# Altium schematic sheet FPGA-Oscilloscope.SchDoc: FPGA Oscilloscope
size C; Author: Albert Gural; DrawnBy: Albert Gural; Engineer: Albert Gural; Revision: 1; SheetNumber: 1; DocumentName: FPGA Oscilloscope
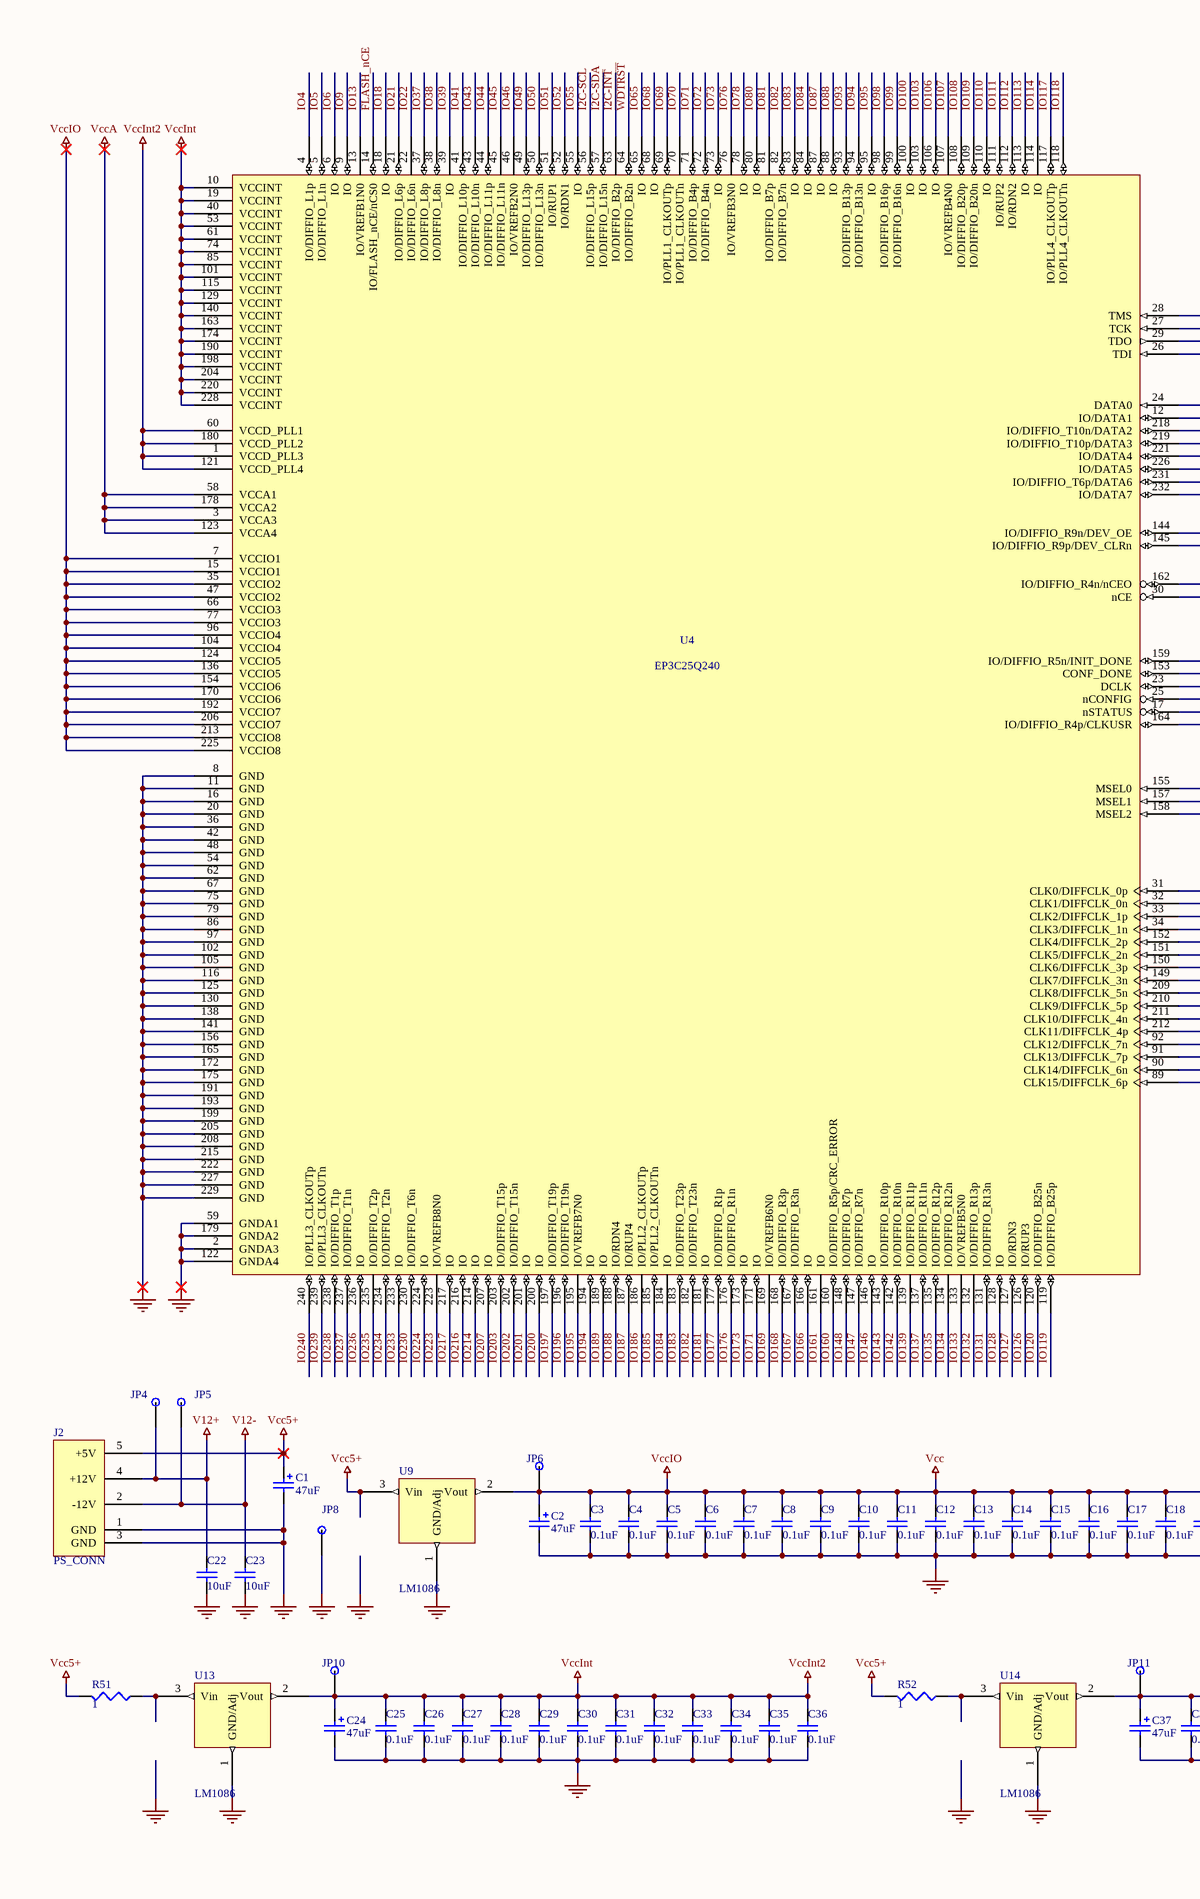
[diagram p0: FPGA-Oscilloscope.SchDoc, left]
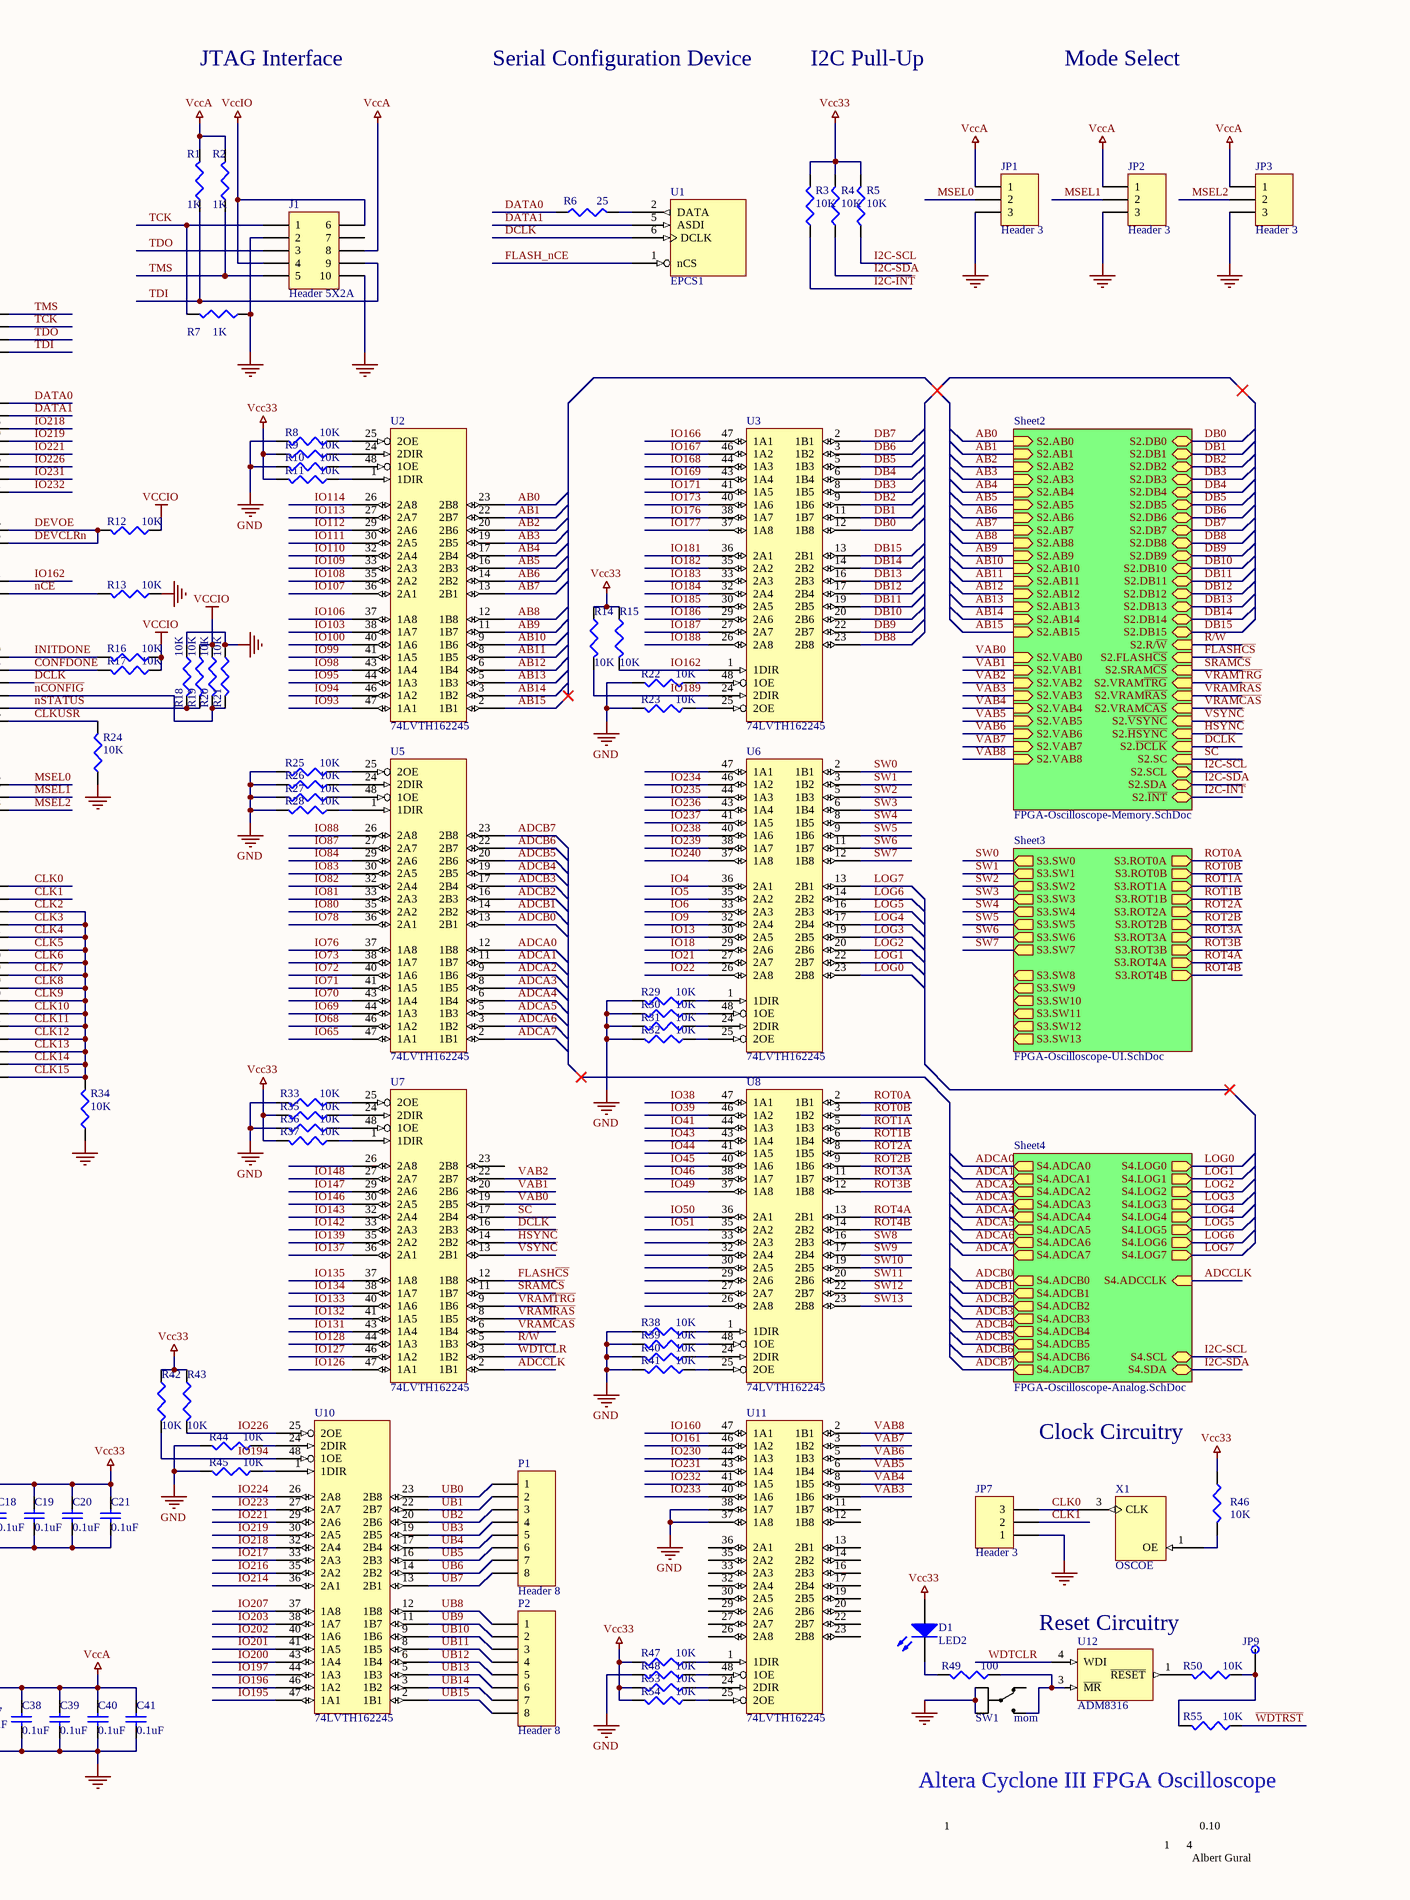
[diagram p1: FPGA-Oscilloscope.SchDoc, right]

## Parts
C1  47uF  [CAPR5-4X5]
C2  47uF  [CAPR5-4X5]
C3  0.1uF  [1608[0603]]
C4  0.1uF  [1608[0603]]
C5  0.1uF  [1608[0603]]
C6  0.1uF  [1608[0603]]
C7  0.1uF  [1608[0603]]
C8  0.1uF  [1608[0603]]
C9  0.1uF  [1608[0603]]
C10  0.1uF  [1608[0603]]
C11  0.1uF  [1608[0603]]
C12  0.1uF  [1608[0603]]
C13  0.1uF  [1608[0603]]
C14  0.1uF  [1608[0603]]
C15  0.1uF  [1608[0603]]
C16  0.1uF  [1608[0603]]
C17  0.1uF  [1608[0603]]
C18  0.1uF  [1608[0603]]
C19  0.1uF  [1608[0603]]
C20  0.1uF  [1608[0603]]
C21  0.1uF  [1608[0603]]
C22  10uF  [1608[0603]]
C23  10uF  [1608[0603]]
C24  47uF  [CAPR5-4X5]
C25  0.1uF  [1608[0603]]
C26  0.1uF  [1608[0603]]
C27  0.1uF  [1608[0603]]
C28  0.1uF  [1608[0603]]
C29  0.1uF  [1608[0603]]
C30  0.1uF  [1608[0603]]
C31  0.1uF  [1608[0603]]
C32  0.1uF  [1608[0603]]
C33  0.1uF  [1608[0603]]
C34  0.1uF  [1608[0603]]
C35  0.1uF  [1608[0603]]
C36  0.1uF  [1608[0603]]
C37  47uF  [CAPR5-4X5]
C38  0.1uF  [1608[0603]]
C39  0.1uF  [1608[0603]]
C40  0.1uF  [1608[0603]]
C41  0.1uF  [1608[0603]]
D1  LED2  [3.2X1.6X1.1]
J1  Header 5X2A  [HDR2X5_CEN]
J2  PS_CONN  [DIN5]
JP1  Header 3  [HDR1X3]
JP2  Header 3  [HDR1X3]
JP3  Header 3  [HDR1X3]
JP4  TestPoint  [TestPoint]  (value not drawn)
JP5  TestPoint  [TestPoint]  (value not drawn)
JP6  TestPoint  [TestPoint]  (value not drawn)
JP7  Header 3  [HDR1X3]
JP8  TestPoint  [TestPoint]  (value not drawn)
JP9  TestPoint  [TestPoint]  (value not drawn)
JP10  TestPoint  [TestPoint]  (value not drawn)
JP11  TestPoint  [TestPoint]  (value not drawn)
P1  Header 8  [HDR1X8]
P2  Header 8  [HDR1X8]
R1  1K  [1608[0603]]
R2  1K  [1608[0603]]
R3  10K  [1608[0603]]
R4  10K  [1608[0603]]
R5  10K  [1608[0603]]
R6  25  [1608[0603]]
R7  1K  [1608[0603]]
R8  10K  [1608[0603]]
R9  10K  [1608[0603]]
R10  10K  [1608[0603]]
R11  10K  [1608[0603]]
R12  10K  [1608[0603]]
R13  10K  [1608[0603]]
R14  10K  [1608[0603]]
R15  10K  [1608[0603]]
R16  10K  [1608[0603]]
R17  10K  [1608[0603]]
R18  10K  [1608[0603]]
R19  10K  [1608[0603]]
R20  10K  [1608[0603]]
R21  10K  [1608[0603]]
R22  10K  [1608[0603]]
R23  10K  [1608[0603]]
R24  10K  [1608[0603]]
R25  10K  [1608[0603]]
R26  10K  [1608[0603]]
R27  10K  [1608[0603]]
R28  10K  [1608[0603]]
R29  10K  [1608[0603]]
R30  10K  [1608[0603]]
R31  10K  [1608[0603]]
R32  10K  [1608[0603]]
R33  10K  [1608[0603]]
R34  10K  [1608[0603]]
R35  10K  [1608[0603]]
R36  10K  [1608[0603]]
R37  10K  [1608[0603]]
R38  10K  [1608[0603]]
R39  10K  [1608[0603]]
R40  10K  [1608[0603]]
R41  10K  [1608[0603]]
R42  10K  [1608[0603]]
R43  10K  [1608[0603]]
R44  10K  [1608[0603]]
R45  10K  [1608[0603]]
R46  10K  [1608[0603]]
R47  10K  [1608[0603]]
R48  10K  [1608[0603]]
R49  100  [1608[0603]]
R50  10K  [1608[0603]]
R51  1  [AXIAL-0.7]
R52  1  [AXIAL-0.7]
R53  10K  [1608[0603]]
R54  10K  [1608[0603]]
R55  10K  [1608[0603]]
SW1  mom  [SPDT]
U1  EPCS1  [SO-8]
U2  74LVTH162245  [TSSOP48]
U3  74LVTH162245  [TSSOP48]
U4  EP3C25Q240  [PQFP240]
U5  74LVTH162245  [TSSOP48]
U6  74LVTH162245  [TSSOP48]
U7  74LVTH162245  [TSSOP48]
U8  74LVTH162245  [TSSOP48]
U9  LM1086  [TO-263]
U10  74LVTH162245  [TSSOP48]
U11  74LVTH162245  [TSSOP48]
U12  ADM8316  [SOT-23]
U13  LM1086  [TO-263]
U14  LM1086  [TO-263]
X1  OSCOE  [OSC-3.2x2.5]

## Sub-sheets
Sheet2 = FPGA-Oscilloscope-Memory.SchDoc: S2.AB0 (in), S2.AB1 (in), S2.AB2 (in), S2.AB3 (in), S2.AB4 (in), S2.AB5 (in), S2.AB6 (in), S2.AB7 (in), S2.AB8 (in), S2.AB9 (in), S2.AB10 (in), S2.AB11 (in), S2.AB12 (in), S2.AB13 (in), S2.AB14 (in), S2.AB15 (in), S2.DB0 (bidir), S2.DB1 (bidir), S2.DB2 (bidir), S2.DB3 (bidir), S2.DB4 (bidir), S2.DB5 (bidir), S2.DB6 (bidir), S2.DB7 (bidir), S2.DB8 (bidir), S2.DB9 (bidir), S2.DB10 (bidir), S2.DB11 (bidir), S2.DB12 (bidir), S2.DB13 (bidir), S2.DB14 (bidir), S2.DB15 (bidir), S2.R/~{W} (in), S2.FLASH~{CS} (in), S2.SRAM~{CS} (in), S2.VRAM~{TRG} (in), S2.VRAM~{RAS} (in), S2.VRAM~{CAS} (in), S2.SC (in), S2.~{DCLK} (in), S2.~{HSYNC} (in), S2.~{VSYNC} (in), S2.SCL (bidir), S2.SDA (bidir), S2.~{INT} (bidir), S2.VAB0 (in), S2.VAB1 (in), S2.VAB2 (in), S2.VAB3 (in), S2.VAB4 (in), S2.VAB5 (in), S2.VAB6 (in), S2.VAB7 (in), S2.VAB8 (in)
Sheet3 = FPGA-Oscilloscope-UI.SchDoc: S3.SW0 (out), S3.SW1 (out), S3.SW2 (out), S3.SW3 (out), S3.SW4 (out), S3.SW5 (out), S3.SW6 (out), S3.SW7 (out), S3.SW8 (out), S3.SW9 (out), S3.SW10 (out), S3.SW11 (out), S3.SW12 (out), S3.SW13 (out), S3.ROT0A (out), S3.ROT0B (out), S3.ROT1A (out), S3.ROT1B (out), S3.ROT2A (out), S3.ROT2B (out), S3.ROT3A (out), S3.ROT3B (out), S3.ROT4A (out), S3.ROT4B (out)
Sheet4 = FPGA-Oscilloscope-Analog.SchDoc: S4.ADCA0 (out), S4.LOG0 (out), S4.SCL (bidir), S4.SDA (bidir), S4.ADCCLK (in), S4.ADCA1 (out), S4.ADCA2 (out), S4.ADCA3 (out), S4.ADCA4 (out), S4.ADCA5 (out), S4.ADCA6 (out), S4.ADCA7 (out), S4.LOG1 (out), S4.LOG2 (out), S4.LOG3 (out), S4.LOG4 (out), S4.LOG5 (out), S4.LOG6 (out), S4.LOG7 (out), S4.ADCB0 (out), S4.ADCB1 (out), S4.ADCB2 (out), S4.ADCB3 (out), S4.ADCB4 (out), S4.ADCB5 (out), S4.ADCB6 (out), S4.ADCB7 (out)

## Nets
GND: C1.2 C2.2 C3.1 C4.1 C5.1 C6.1 C7.1 C8.1 C9.1 C10.1 C11.1 C12.1 C13.1 C14.1 C15.1 C16.1 C17.1 C18.1 C19.1 C20.1 C21.1 C22.1 C23.1 C24.2 C25.1 C26.1 C27.1 C28.1 C29.1 C30.1 C31.1 C32.1 C33.1 C34.1 C35.1 C36.1 C37.2 C38.1 C39.1 C40.1 C41.1 J1.2 J1.10 J2.1(GND) J2.3(GND) JP1.3 JP2.3 JP3.3 JP7.1 JP8.1 R7.1 R8.2 R10.2 R13.1 R18.1 R21.1 R22.2 R23.2 R24.1 R25.2 R26.2 R27.2 R28.2 R29.2 R30.2 R31.2 R32.2 R33.2 R34.1 R36.2 R38.2 R39.2 R40.2 R41.2 R44.2 R45.2 R48.2 SW1.C U1.4(GND) U2.4(GND) U2.10(GND) U2.15(GND) U2.21(GND) U2.28(GND) U2.34(GND) U2.39(GND) U2.45(GND) U3.4(GND) U3.10(GND) U3.15(GND) U3.21(GND) U3.28(GND) U3.34(GND) U3.39(GND) U3.45(GND) U4.2(GNDA3) U4.8(GND) U4.11(GND) U4.16(GND) U4.20(GND) U4.36(GND) U4.42(GND) U4.48(GND) U4.54(GND) U4.59(GNDA1) U4.62(GND) U4.67(GND) U4.75(GND) U4.79(GND) U4.86(GND) U4.97(GND) U4.102(GND) U4.105(GND) U4.116(GND) U4.122(GNDA4) U4.125(GND) U4.130(GND) U4.138(GND) U4.141(GND) U4.156(GND) U4.165(GND) U4.172(GND) U4.175(GND) U4.179(GNDA2) U4.191(GND) U4.193(GND) U4.199(GND) U4.205(GND) U4.208(GND) U4.215(GND) U4.222(GND) U4.227(GND) U4.229(GND) U5.4(GND) U5.10(GND) U5.15(GND) U5.21(GND) U5.28(GND) U5.34(GND) U5.39(GND) U5.45(GND) U6.4(GND) U6.10(GND) U6.15(GND) U6.21(GND) U6.28(GND) U6.34(GND) U6.39(GND) U6.45(GND) U7.4(GND) U7.10(GND) U7.15(GND) U7.21(GND) U7.28(GND) U7.34(GND) U7.39(GND) U7.45(GND) U8.4(GND) U8.10(GND) U8.15(GND) U8.21(GND) U8.28(GND) U8.34(GND) U8.39(GND) U8.45(GND) U9.1(GND/Adj) U10.4(GND) U10.10(GND) U10.15(GND) U10.21(GND) U10.28(GND) U10.34(GND) U10.39(GND) U10.45(GND) U11.4(GND) U11.10(GND) U11.15(GND) U11.21(GND) U11.28(GND) U11.34(GND) U11.37(1A8) U11.38(1A7) U11.39(GND) U11.45(GND) U12.2(GND) U13.1(GND/Adj) U14.1(GND/Adj) X1.2(GND)
V12+: C22.2 J2.4(+12V) JP4.1
V12-: C23.2 J2.2(-12V) JP5.1
Vcc: C2.1 C3.2 C4.2 C5.2 C6.2 C7.2 C8.2 C9.2 C10.2 C11.2 C12.2 C13.2 C14.2 C15.2 C16.2 C17.2 C18.2 C19.2 C20.2 C21.2 D1.1(A) J1.4 J1.6 JP6.1 R3.2 R4.2 R5.2 R9.2 R11.2 R12.1 R14.1 R15.1 R16.1 R17.1 R19.1 R20.1 R35.2 R37.2 R42.1 R43.1 R46.1 R47.2 R53.2 R54.2 U1.3(Vcc) U1.7(Vcc) U1.8(Vcc) U2.7(Vcc33) U2.18(Vcc33) U2.31(Vcc33) U2.42(Vcc33) U3.7(Vcc33) U3.18(Vcc33) U3.31(Vcc33) U3.42(Vcc33) U4.7(VCCIO1) U4.15(VCCIO1) U4.35(VCCIO2) U4.47(VCCIO2) U4.66(VCCIO3) U4.77(VCCIO3) U4.96(VCCIO4) U4.104(VCCIO4) U4.124(VCCIO5) U4.136(VCCIO5) U4.154(VCCIO6) U4.170(VCCIO6) U4.192(VCCIO7) U4.206(VCCIO7) U4.213(VCCIO8) U4.225(VCCIO8) U5.7(Vcc33) U5.18(Vcc33) U5.31(Vcc33) U5.42(Vcc33) U6.7(Vcc33) U6.18(Vcc33) U6.31(Vcc33) U6.42(Vcc33) U7.7(Vcc33) U7.18(Vcc33) U7.31(Vcc33) U7.42(Vcc33) U8.7(Vcc33) U8.18(Vcc33) U8.31(Vcc33) U8.42(Vcc33) U9.2(Vout) U10.7(Vcc33) U10.18(Vcc33) U10.31(Vcc33) U10.42(Vcc33) U11.7(Vcc33) U11.18(Vcc33) U11.31(Vcc33) U11.42(Vcc33) U12.5(VCC) X1.4(VCC)  [also labelled Vcc33, VccIO]
Vcc5+: C1.1 J2.5(+5V) R51.2 R52.2 U9.3(Vin)
VccA: C37.1 C38.2 C39.2 C40.2 C41.2 J1.8 JP1.1 JP2.1 JP3.1 JP11.1 R1.2 R2.2 U4.3(VCCA3) U4.58(VCCA1) U4.123(VCCA4) U4.178(VCCA2) U14.2(Vout)
VccInt: C24.1 C25.2 C26.2 C27.2 C28.2 C29.2 C30.2 C31.2 C32.2 C33.2 C34.2 C35.2 C36.2 JP10.1 U4.1(VCCD_PLL3) U4.10(VCCINT) U4.19(VCCINT) U4.40(VCCINT) U4.53(VCCINT) U4.60(VCCD_PLL1) U4.61(VCCINT) U4.74(VCCINT) U4.85(VCCINT) U4.101(VCCINT) U4.115(VCCINT) U4.121(VCCD_PLL4) U4.129(VCCINT) U4.140(VCCINT) U4.163(VCCINT) U4.174(VCCINT) U4.180(VCCD_PLL2) U4.190(VCCINT) U4.198(VCCINT) U4.204(VCCINT) U4.220(VCCINT) U4.228(VCCINT) U13.2(Vout)  [also labelled VccInt2]
AB0: U2.23(2B8) ; sheet Sheet2/S2.AB0
AB1: U2.22(2B7) ; sheet Sheet2/S2.AB1
AB2: U2.20(2B6) ; sheet Sheet2/S2.AB2
AB3: U2.19(2B5) ; sheet Sheet2/S2.AB3
AB4: U2.17(2B4) ; sheet Sheet2/S2.AB4
AB5: U2.16(2B3) ; sheet Sheet2/S2.AB5
AB6: U2.14(2B2) ; sheet Sheet2/S2.AB6
AB7: U2.13(2B1) ; sheet Sheet2/S2.AB7
AB8: U2.12(1B8) ; sheet Sheet2/S2.AB8
AB9: U2.11(1B7) ; sheet Sheet2/S2.AB9
AB10: U2.9(1B6) ; sheet Sheet2/S2.AB10
AB11: U2.8(1B5) ; sheet Sheet2/S2.AB11
AB12: U2.6(1B4) ; sheet Sheet2/S2.AB12
AB13: U2.5(1B3) ; sheet Sheet2/S2.AB13
AB14: U2.3(1B2) ; sheet Sheet2/S2.AB14
AB15: U2.2(1B1) ; sheet Sheet2/S2.AB15
ADCA0: U5.12(1B8) ; sheet Sheet4/S4.ADCA0
ADCA1: U5.11(1B7) ; sheet Sheet4/S4.ADCA1
ADCA2: U5.9(1B6) ; sheet Sheet4/S4.ADCA2
ADCA3: U5.8(1B5) ; sheet Sheet4/S4.ADCA3
ADCA4: U5.6(1B4) ; sheet Sheet4/S4.ADCA4
ADCA5: U5.5(1B3) ; sheet Sheet4/S4.ADCA5
ADCA6: U5.3(1B2) ; sheet Sheet4/S4.ADCA6
ADCA7: U5.2(1B1) ; sheet Sheet4/S4.ADCA7
ADCB0: U5.13(2B1) ; sheet Sheet4/S4.ADCB0
ADCB1: U5.14(2B2) ; sheet Sheet4/S4.ADCB1
ADCB2: U5.16(2B3) ; sheet Sheet4/S4.ADCB2
ADCB3: U5.17(2B4) ; sheet Sheet4/S4.ADCB3
ADCB4: U5.19(2B5) ; sheet Sheet4/S4.ADCB4
ADCB5: U5.20(2B6) ; sheet Sheet4/S4.ADCB5
ADCB6: U5.22(2B7) ; sheet Sheet4/S4.ADCB6
ADCB7: U5.23(2B8) ; sheet Sheet4/S4.ADCB7
ADCCLK: U7.2(1B1) ; sheet Sheet4/S4.ADCCLK
CLK0: JP7.3 U4.31(CLK0/DIFFCLK_0p) X1.3(CLK)
CLK1: JP7.2 U4.32(CLK1/DIFFCLK_0n)
CLK10: R34.2 U4.33(CLK2/DIFFCLK_1p) U4.34(CLK3/DIFFCLK_1n) U4.89(CLK15/DIFFCLK_6p) U4.90(CLK14/DIFFCLK_6n) U4.91(CLK13/DIFFCLK_7p) U4.92(CLK12/DIFFCLK_7n) U4.149(CLK7/DIFFCLK_3n) U4.150(CLK6/DIFFCLK_3p) U4.151(CLK5/DIFFCLK_2n) U4.152(CLK4/DIFFCLK_2p) U4.209(CLK8/DIFFCLK_5n) U4.210(CLK9/DIFFCLK_5p) U4.211(CLK10/DIFFCLK_4n) U4.212(CLK11/DIFFCLK_4p)  [also labelled CLK11, CLK12, CLK13, CLK14, CLK15, CLK2, CLK3, CLK4, CLK5, CLK6, CLK7, CLK8, CLK9]
CLKUSR: R24.2 U4.164(IO/DIFFIO_R4p/CLKUSR)
CONFDONE: R17.2 U4.153(CONF_DONE)
~{DCLK}: U7.16(2B3) ; sheet Sheet2/S2.~{DCLK}
DATA0: R6.1 U4.24(DATA0)
DATA1: U1.5(ASDI) U4.12(IO/DATA1)
DB0: U3.12(1B8) ; sheet Sheet2/S2.DB0
DB1: U3.11(1B7) ; sheet Sheet2/S2.DB1
DB2: U3.9(1B6) ; sheet Sheet2/S2.DB2
DB3: U3.8(1B5) ; sheet Sheet2/S2.DB3
DB4: U3.6(1B4) ; sheet Sheet2/S2.DB4
DB5: U3.5(1B3) ; sheet Sheet2/S2.DB5
DB6: U3.3(1B2) ; sheet Sheet2/S2.DB6
DB7: U3.2(1B1) ; sheet Sheet2/S2.DB7
DB8: U3.23(2B8) ; sheet Sheet2/S2.DB8
DB9: U3.22(2B7) ; sheet Sheet2/S2.DB9
DB10: U3.20(2B6) ; sheet Sheet2/S2.DB10
DB11: U3.19(2B5) ; sheet Sheet2/S2.DB11
DB12: U3.17(2B4) ; sheet Sheet2/S2.DB12
DB13: U3.16(2B3) ; sheet Sheet2/S2.DB13
DB14: U3.14(2B2) ; sheet Sheet2/S2.DB14
DB15: U3.13(2B1) ; sheet Sheet2/S2.DB15
DCLK: U1.6(DCLK) U4.23(DCLK)
DEVCLRn: R12.2 U4.144(IO/DIFFIO_R9n/DEV_OE) U4.145(IO/DIFFIO_R9p/DEV_CLRn)  [also labelled DEVOE]
FLASH_nCE: U1.1(nCS) U4.14(IO/FLASH_nCE/nCS0)
FLASH~{CS}: U7.12(1B8) ; sheet Sheet2/S2.FLASH~{CS}
~{HSYNC}: U7.14(2B2) ; sheet Sheet2/S2.~{HSYNC}
I2C-~{INT}: R3.1 U4.63(IO/DIFFIO_B2p) ; sheet Sheet2/S2.~{INT}
I2C-SCL: R5.1 U4.56(IO/DIFFIO_L15p) ; sheet Sheet2/S2.SCL, sheet Sheet4/S4.SCL
I2C-SDA: R4.1 U4.57(IO/DIFFIO_L15n) ; sheet Sheet2/S2.SDA, sheet Sheet4/S4.SDA
INITDONE: R16.2 U4.159(IO/DIFFIO_R5n/INIT_DONE)
IO4: U4.4(IO/DIFFIO_L1p) U6.36(2A1)
IO5: U4.5(IO/DIFFIO_L1n) U6.35(2A2)
IO6: U4.6(IO) U6.33(2A3)
IO9: U4.9(IO) U6.32(2A4)
IO13: U4.13(IO/VREFB1N0) U6.30(2A5)
IO18: U4.18(IO) U6.29(2A6)
IO21: U4.21(IO/DIFFIO_L6p) U6.27(2A7)
IO22: U4.22(IO/DIFFIO_L6n) U6.26(2A8)
IO37: U4.37(IO/DIFFIO_L8p)
IO38: U4.38(IO/DIFFIO_L8n) U8.47(1A1)
IO39: U4.39(IO) U8.46(1A2)
IO41: U4.41(IO/DIFFIO_L10p) U8.44(1A3)
IO43: U4.43(IO/DIFFIO_L10n) U8.43(1A4)
IO44: U4.44(IO/DIFFIO_L11p) U8.41(1A5)
IO45: U4.45(IO/DIFFIO_L11n) U8.40(1A6)
IO46: U4.46(IO/VREFB2N0) U8.38(1A7)
IO49: U4.49(IO/DIFFIO_L13p) U8.37(1A8)
IO50: U4.50(IO/DIFFIO_L13n) U8.36(2A1)
IO51: U4.51(IO/RUP1) U8.35(2A2)
IO52: U4.52(IO/RDN1)
IO55: U4.55(IO)
IO65: U4.65(IO) U5.47(1A1)
IO68: U4.68(IO) U5.46(1A2)
IO69: U4.69(IO/PLL1_CLKOUTp) U5.44(1A3)
IO70: U4.70(IO/PLL1_CLKOUTn) U5.43(1A4)
IO71: U4.71(IO/DIFFIO_B4p) U5.41(1A5)
IO72: U4.72(IO/DIFFIO_B4n) U5.40(1A6)
IO73: U4.73(IO) U5.38(1A7)
IO76: U4.76(IO/VREFB3N0) U5.37(1A8)
IO78: U4.78(IO) U5.36(2A1)
IO80: U4.80(IO) U5.35(2A2)
IO81: U4.81(IO/DIFFIO_B7p) U5.33(2A3)
IO82: U4.82(IO/DIFFIO_B7n) U5.32(2A4)
IO83: U4.83(IO) U5.30(2A5)
IO84: U4.84(IO) U5.29(2A6)
IO87: U4.87(IO) U5.27(2A7)
IO88: U4.88(IO) U5.26(2A8)
IO93: U2.47(1A1) U4.93(IO/DIFFIO_B13p)
IO94: U2.46(1A2) U4.94(IO/DIFFIO_B13n)
IO95: U2.44(1A3) U4.95(IO)
IO98: U2.43(1A4) U4.98(IO/DIFFIO_B16p)
IO99: U2.41(1A5) U4.99(IO/DIFFIO_B16n)
IO100: U2.40(1A6) U4.100(IO)
IO103: U2.38(1A7) U4.103(IO)
IO106: U2.37(1A8) U4.106(IO)
IO107: U2.36(2A1) U4.107(IO/VREFB4N0)
IO108: U2.35(2A2) U4.108(IO/DIFFIO_B20p)
IO109: U2.33(2A3) U4.109(IO/DIFFIO_B20n)
IO110: U2.32(2A4) U4.110(IO)
IO111: U2.30(2A5) U4.111(IO/RUP2)
IO112: U2.29(2A6) U4.112(IO/RDN2)
IO113: U2.27(2A7) U4.113(IO)
IO114: U2.26(2A8) U4.114(IO)
IO117: U4.117(IO/PLL4_CLKOUTp)
IO118: U4.118(IO/PLL4_CLKOUTn)
IO119: U4.119(IO/DIFFIO_B25p)
IO120: U4.120(IO/DIFFIO_B25n)
IO126: U4.126(IO/RUP3) U7.47(1A1)
IO127: U4.127(IO/RDN3) U7.46(1A2)
IO128: U4.128(IO) U7.44(1A3)
IO131: U4.131(IO/DIFFIO_R13n) U7.43(1A4)
IO132: U4.132(IO/DIFFIO_R13p) U7.41(1A5)
IO133: U4.133(IO/VREFB5N0) U7.40(1A6)
IO134: U4.134(IO/DIFFIO_R12n) U7.38(1A7)
IO135: U4.135(IO/DIFFIO_R12p) U7.37(1A8)
IO137: U4.137(IO/DIFFIO_R11n) U7.36(2A1)
IO139: U4.139(IO/DIFFIO_R11p) U7.35(2A2)
IO142: U4.142(IO/DIFFIO_R10n) U7.33(2A3)
IO143: U4.143(IO/DIFFIO_R10p) U7.32(2A4)
IO146: U4.146(IO) U7.30(2A5)
IO147: U4.147(IO/DIFFIO_R7n) U7.29(2A6)
IO148: U4.148(IO/DIFFIO_R7p) U7.27(2A7)
IO160: U4.160(IO/DIFFIO_R5p/CRC_ERROR) U11.47(1A1)
IO161: U4.161(IO) U11.46(1A2)
IO162: R15.2 U3.1(1DIR) U4.162(IO/DIFFIO_R4n/nCEO)
IO166: U3.47(1A1) U4.166(IO)
IO167: U3.46(1A2) U4.167(IO/DIFFIO_R3n)
IO168: U3.44(1A3) U4.168(IO/DIFFIO_R3p)
IO169: U3.43(1A4) U4.169(IO/VREFB6N0)
IO171: U3.41(1A5) U4.171(IO)
IO173: U3.40(1A6) U4.173(IO)
IO176: U3.38(1A7) U4.176(IO/DIFFIO_R1n)
IO177: U3.37(1A8) U4.177(IO/DIFFIO_R1p)
IO181: U3.36(2A1) U4.181(IO)
IO182: U3.35(2A2) U4.182(IO/DIFFIO_T23n)
IO183: U3.33(2A3) U4.183(IO/DIFFIO_T23p)
IO184: U3.32(2A4) U4.184(IO)
IO185: U3.30(2A5) U4.185(IO/PLL2_CLKOUTn)
IO186: U3.29(2A6) U4.186(IO/PLL2_CLKOUTp)
IO187: U3.27(2A7) U4.187(IO/RUP4)
IO188: U3.26(2A8) U4.188(IO/RDN4)
IO189: R14.2 U3.24(2DIR) U4.189(IO)
IO194: R42.2 U4.194(IO) U10.48(1OE)
IO195: U4.195(IO/VREFB7N0) U10.47(1A1)
IO196: U4.196(IO/DIFFIO_T19n) U10.46(1A2)
IO197: U4.197(IO/DIFFIO_T19p) U10.44(1A3)
IO200: U4.200(IO) U10.43(1A4)
IO201: U4.201(IO) U10.41(1A5)
IO202: U4.202(IO/DIFFIO_T15n) U10.40(1A6)
IO203: U4.203(IO/DIFFIO_T15p) U10.38(1A7)
IO207: U4.207(IO) U10.37(1A8)
IO214: U4.214(IO) U10.36(2A1)
IO216: U4.216(IO) U10.35(2A2)
IO217: U4.217(IO) U10.33(2A3)
IO218: U4.218(IO/DIFFIO_T10n/DATA2) U10.32(2A4)
IO219: U4.219(IO/DIFFIO_T10p/DATA3) U10.30(2A5)
IO221: U4.221(IO/DATA4) U10.29(2A6)
IO223: U4.223(IO/VREFB8N0) U10.27(2A7)
IO224: U4.224(IO) U10.26(2A8)
IO226: R43.2 U4.226(IO/DATA5) U10.25(2OE)
IO230: U4.230(IO/DIFFIO_T6n) U11.44(1A3)
IO231: U4.231(IO/DIFFIO_T6p/DATA6) U11.43(1A4)
IO232: U4.232(IO/DATA7) U11.41(1A5)
IO233: U4.233(IO) U11.40(1A6)
IO234: U4.234(IO/DIFFIO_T2n) U6.46(1A2)
IO235: U4.235(IO/DIFFIO_T2p) U6.44(1A3)
IO236: U4.236(IO) U6.43(1A4)
IO237: U4.237(IO/DIFFIO_T1n) U6.41(1A5)
IO238: U4.238(IO/DIFFIO_T1p) U6.40(1A6)
IO239: U4.239(IO/PLL3_CLKOUTn) U6.38(1A7)
IO240: U4.240(IO/PLL3_CLKOUTp) U6.37(1A8)
LOG0: U6.23(2B8) ; sheet Sheet4/S4.LOG0
LOG1: U6.22(2B7) ; sheet Sheet4/S4.LOG1
LOG2: U6.20(2B6) ; sheet Sheet4/S4.LOG2
LOG3: U6.19(2B5) ; sheet Sheet4/S4.LOG3
LOG4: U6.17(2B4) ; sheet Sheet4/S4.LOG4
LOG5: U6.16(2B3) ; sheet Sheet4/S4.LOG5
LOG6: U6.14(2B2) ; sheet Sheet4/S4.LOG6
LOG7: U6.13(2B1) ; sheet Sheet4/S4.LOG7
MSEL0: JP1.2 U4.155(MSEL0)
MSEL1: JP2.2 U4.157(MSEL1)
MSEL2: JP3.2 U4.158(MSEL2)
~{nCE}: R13.2 U4.30(nCE)
~{nCONFIG}: R20.2 R21.2 U4.25(nCONFIG)
~{nSTATUS}: R18.2 R19.2 U4.17(nSTATUS)
R/~{W}: U7.5(1B3) ; sheet Sheet2/S2.R/~{W}
ROT0A: U8.2(1B1) ; sheet Sheet3/S3.ROT0A
ROT0B: U8.3(1B2) ; sheet Sheet3/S3.ROT0B
ROT1A: U8.5(1B3) ; sheet Sheet3/S3.ROT1A
ROT1B: U8.6(1B4) ; sheet Sheet3/S3.ROT1B
ROT2A: U8.8(1B5) ; sheet Sheet3/S3.ROT2A
ROT2B: U8.9(1B6) ; sheet Sheet3/S3.ROT2B
ROT3A: U8.11(1B7) ; sheet Sheet3/S3.ROT3A
ROT3B: U8.12(1B8) ; sheet Sheet3/S3.ROT3B
ROT4A: U8.13(2B1) ; sheet Sheet3/S3.ROT4A
ROT4B: U8.14(2B2) ; sheet Sheet3/S3.ROT4B
SC: U7.17(2B4) ; sheet Sheet2/S2.SC
SRAM~{CS}: U7.11(1B7) ; sheet Sheet2/S2.SRAM~{CS}
SW0: U6.2(1B1) ; sheet Sheet3/S3.SW0
SW1: U6.3(1B2) ; sheet Sheet3/S3.SW1
SW2: U6.5(1B3) ; sheet Sheet3/S3.SW2
SW3: U6.6(1B4) ; sheet Sheet3/S3.SW3
SW4: U6.8(1B5) ; sheet Sheet3/S3.SW4
SW5: U6.9(1B6) ; sheet Sheet3/S3.SW5
SW6: U6.11(1B7) ; sheet Sheet3/S3.SW6
SW7: U6.12(1B8) ; sheet Sheet3/S3.SW7
SW8: U8.16(2B3)
SW9: U8.17(2B4)
SW10: U8.19(2B5)
SW11: U8.20(2B6)
SW12: U8.22(2B7)
SW13: U8.23(2B8)
TCK: J1.1 R7.2 U4.27(TCK)
TDI: J1.9 R1.1 U4.26(TDI)
TDO: J1.3 U4.29(TDO)
TMS: J1.5 R2.1 U4.28(TMS)
UB0: P1.1 U10.23(2B8)
UB1: P1.2 U10.22(2B7)
UB2: P1.3 U10.20(2B6)
UB3: P1.4 U10.19(2B5)
UB4: P1.5 U10.17(2B4)
UB5: P1.6 U10.16(2B3)
UB6: P1.7 U10.14(2B2)
UB7: P1.8 U10.13(2B1)
UB8: P2.1 U10.12(1B8)
UB9: P2.2 U10.11(1B7)
UB10: P2.3 U10.9(1B6)
UB11: P2.4 U10.8(1B5)
UB12: P2.5 U10.6(1B4)
UB13: P2.6 U10.5(1B3)
UB14: P2.7 U10.3(1B2)
UB15: P2.8 U10.2(1B1)
~{VSYNC}: U7.13(2B1) ; sheet Sheet2/S2.~{VSYNC}
VAB0: U7.19(2B5) ; sheet Sheet2/S2.VAB0
VAB1: U7.20(2B6) ; sheet Sheet2/S2.VAB1
VAB2: U7.22(2B7) ; sheet Sheet2/S2.VAB2
VAB3: U11.9(1B6) ; sheet Sheet2/S2.VAB3
VAB4: U11.8(1B5) ; sheet Sheet2/S2.VAB4
VAB5: U11.6(1B4) ; sheet Sheet2/S2.VAB5
VAB6: U11.5(1B3) ; sheet Sheet2/S2.VAB6
VAB7: U11.3(1B2) ; sheet Sheet2/S2.VAB7
VAB8: U11.2(1B1) ; sheet Sheet2/S2.VAB8
VRAM~{CAS}: U7.6(1B4) ; sheet Sheet2/S2.VRAM~{CAS}
VRAM~{RAS}: U7.8(1B5) ; sheet Sheet2/S2.VRAM~{RAS}
VRAM~{TRG}: U7.9(1B6) ; sheet Sheet2/S2.VRAM~{TRG}
~{WDTRST}: R55.1 U4.64(IO/DIFFIO_B2n)
WDTCLR: U7.3(1B2) U12.4(WDI)
NetD1_2: D1.2(K) R49.2
NetJP9_1: JP9.1 R50.1 R55.2
NetR6_2: R6.2 U1.2(DATA)
NetR8_1: R8.1 U2.25(2OE)
NetR9_1: R9.1 U2.24(2DIR)
NetR10_1: R10.1 U2.48(1OE)
NetR11_1: R11.1 U2.1(1DIR)
NetR22_1: R22.1 U3.48(1OE)
NetR23_1: R23.1 U3.25(2OE)
NetR25_1: R25.1 U5.25(2OE)
NetR26_1: R26.1 U5.24(2DIR)
NetR27_1: R27.1 U5.48(1OE)
NetR28_1: R28.1 U5.1(1DIR)
NetR29_1: R29.1 U6.1(1DIR)
NetR30_1: R30.1 U6.48(1OE)
NetR31_1: R31.1 U6.24(2DIR)
NetR32_1: R32.1 U6.25(2OE)
NetR33_1: R33.1 U7.25(2OE)
NetR35_1: R35.1 U7.24(2DIR)
NetR36_1: R36.1 U7.48(1OE)
NetR37_1: R37.1 U7.1(1DIR)
NetR38_1: R38.1 U8.1(1DIR)
NetR39_1: R39.1 U8.48(1OE)
NetR40_1: R40.1 U8.24(2DIR)
NetR41_1: R41.1 U8.25(2OE)
NetR44_1: R44.1 U10.24(2DIR)
NetR45_1: R45.1 U10.1(1DIR)
NetR46_2: R46.2 X1.1(OE)
NetR47_1: R47.1 U11.1(1DIR)
NetR48_1: R48.1 U11.48(1OE)
NetR49_1: R49.1 SW1.2 U12.3(~{MR})
NetR50_2: R50.2 U12.1(~{RESET})
NetR51_1: R51.1 U13.3(Vin)
NetR52_1: R52.1 U14.3(Vin)
NetR53_1: R53.1 U11.24(2DIR)
NetR54_1: R54.1 U11.25(2OE)

Not connected (* = marked no-connect by the designer): J1 7; SW1 1; U6 47(1A1); U7 23(2B8) 26(2A8); U8 26(2A8) 27(2A7) 29(2A6) 30(2A5) 32(2A4) 33(2A3); U11 11(1B7) 12(1B8) 13(2B1) 14(2B2) 16(2B3) 17(2B4) 19(2B5) 20(2B6) 22(2B7) 23(2B8) 26(2A8) 27(2A7) 29(2A6) 30(2A5) 32(2A4) 33(2A3) 35(2A2) 36(2A1)

## Notes on the sheet
- JTAG Interface
- Serial Configuration Device
- I2C Pull-Up
- Mode Select
- (near R46) Clock Circuitry
- Reset Circuitry
- Altera Cyclone III FPGA Oscilloscope
- 1
- 4
- Albert Gural
- 0.10

## Library data of the parts
C1 C2 C24 C37 = Cap Pol1: Polarized Capacitor (Radial); Published: 8-Jun-2000; LatestRevisionDate: 17-Jul-2002; LatestRevisionNote: Re-released for DXP Platform.; PackageReference: RB7.6-15; Publisher: Altium Limited; PackageDescription: Polarized Capacitor (Radial); 2 Leads
C3-C23 C25-C36 C38-C41 = Cap Semi: Capacitor (Semiconductor SIM Model); Published: 8-Jun-2000; LatestRevisionDate: 29-May-2009; LatestRevisionNote: IPC-7351 Footprint Added.; PackageReference: C1206; Publisher: Altium Limited; PackageDescription: Chip Capacitor
D1 = LED2: Typical RED, GREEN, YELLOW, AMBER GaAs LED; Published: 8-Jun-2000; LatestRevisionDate: 17-Jul-2002; LatestRevisionNote: Re-released for DXP Platform.; PackageVersion: Feb-2002; PackageReference: 3.2X1.6X1.1; Publisher: Altium Limited; PackageDescription: SM LED; 2 Flat Leads
J1 = Header 5X2A: Header, 5-Pin, Dual row; LatestRevisionDate: 17-Jul-2002; LatestRevisionNote: Re-released for DXP Platform.; Publisher: Altium Limited
J2 = PS_CONN: Elpac Compatible Power Supply Connector
JP1-JP3 JP7 = Header 3: Header, 3-Pin; LatestRevisionDate: 17-Jul-2002; LatestRevisionNote: Re-released for DXP Platform.; Publisher: Altium Limited
P1 P2 = Header 8: Header, 8-Pin; LatestRevisionDate: 17-Jul-2002; LatestRevisionNote: Re-released for DXP Platform.; Publisher: Altium Limited
R1-R55 = RES1
SW1 = PVB4-MOM
U1 = EPCS1: Altera Serial Configuration Device
U2 U3 U5-U8 U10 U11 = 74LVTH162245: 16-Bit Bus Transceiver
U4 = EP3C25Q240: Cyclone III EP3C-25 FPGA PQFP240
U9 U13 U14 = LM1086: 1.5A Low Dropout Positive Regulator
U12 = ADM8316: Analog Devices Watchdog Timer and Reset IC
X1 = OSCOE: Oscillator with Active High Output Enable